# EAGLE design ul-18 (EAGLE 4.11)
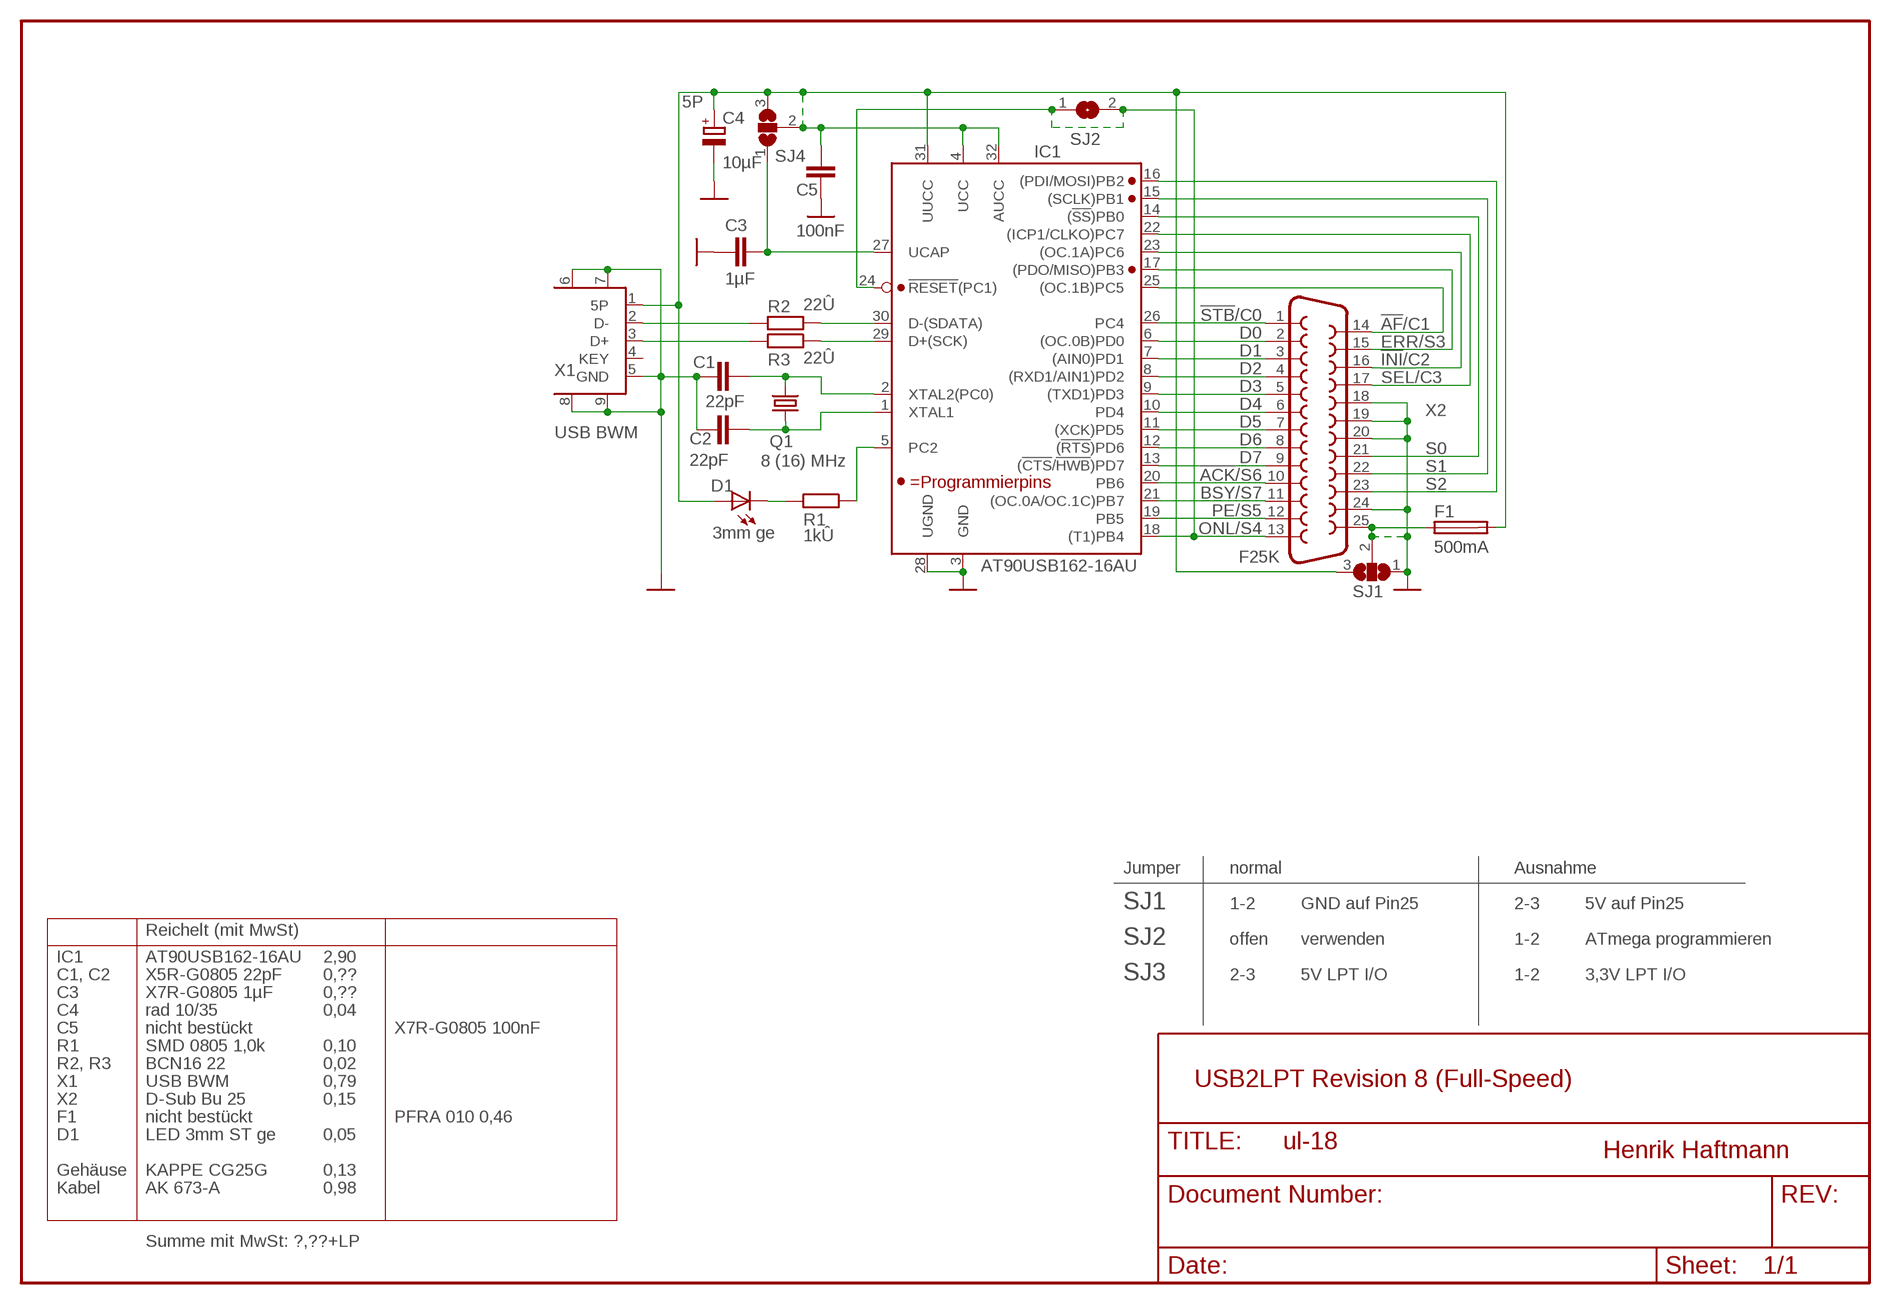
[diagram p0: schematic, sheet 1]

## Parts
C1  22pF  C-EUC0805  [C0805]
C2  22pF  C-EUC0805  [C0805]
C3  1µF  C-EUC0805  [C0805]
C4  10µF  CPOL-EUTT2D5L  [TT2D5L]
C5  100nF  C-EUC0805  [C0805]
D1  3mm ge  LED3MM  [LED3MM]
F1  500mA  TE5  [TE5]
IC1  AT90USB162-16AU  [TQFP32-08]
Q1  8 (16) MHz  CRYTALHC49U-V  [HC49U-V]
R1  1kÛ  R-EU_R0805  [R0805]
R2  22Û  R-EU_R0805  [R0805]
R3  22Û  R-EU_R0805  [R0805]
SJ1  SJ3P  [SJ3P]
SJ2  SJ2P  [SJ2P]
SJ4  SJ3P  [SJ3P]
X1  USB BWM  USB-MINIB-BO-E  [USB-MINIB-BU-E]
X2  F25K  [F25K]

## Nets
3P3: C3.2 IC1.27(UCAP) SJ4.1
5P: C4.+ C5.2 D1.A F1.2 IC1.4(UCC) IC1.31(UUCC) IC1.32(AUCC) SJ1.3 SJ4.2 SJ4.3 X1.1(5P)
!ACK!/S6: IC1.20(PB6) X2.10
!AF!/C1: IC1.25((OC.1B)PC5) X2.14
!INI!/C2: IC1.23((OC.1A)PC6) X2.16
!LED: IC1.5(PC2) R1.1
!SEL!/C3: IC1.22((ICP1/CLKO)PC7) X2.17
!STB!/C0: IC1.26(PC4) X2.1
BSY/S7: IC1.21((OC.0A/OC.1C)PB7) X2.11
D0: IC1.6((OC.0B)PD0) X2.2
D1: IC1.7((AIN0)PD1) X2.3
D2: IC1.8((RXD1/AIN1)PD2) X2.4
D3: IC1.9((TXD1)PD3) X2.5
D4: IC1.10(PD4) X2.6
D5: IC1.11((XCK)PD5) X2.7
D6: IC1.12((!RTS!)PD6) X2.8
D7: IC1.13((!CTS!/!HWB!)PD7) X2.9
D+: R2.2 X1.3(D+)
D-: R3.2 X1.2(D-)
ERR/S3: IC1.17((PDO/MISO)PB3) X2.15
GND: C1.2 C2.2 C3.1 C4.- C5.1 F1.1 IC1.3(GND) IC1.28(UGND) SJ1.1 SJ1.2 X1.5(GND) X1.6(GND) X1.7(GND) X1.8(GND) X1.9(GND) X2.18 X2.19 X2.20 X2.24 X2.25
N$3: IC1.30(D-(SDATA)) R3.1
N$4: IC1.29(D+(SCK)) R2.1
N$7: D1.K R1.2
ONL/S4: IC1.18((T1)PB4) IC1.24(!RESET!(PC1)) SJ2.1 SJ2.2 X2.13
PE/S5: IC1.19(PB5) X2.12
S0: IC1.14((!SS!)PB0) X2.21
S1: IC1.15((SCLK)PB1) X2.22
S2: IC1.16((PDI/MOSI)PB2) X2.23
XTAL1: C2.1 IC1.1(XTAL1) Q1.1
XTAL2: C1.1 IC1.2(XTAL2(PC0)) Q1.2
Unconnected: X1.4(KEY)

## Notes on the sheet
- Jumper | normal | Ausnahme
- SJ1 | 1-2 | GND auf Pin25 | 2-3 | 5V auf Pin25
- Reichelt (mit MwSt)
- SJ2 | offen | verwenden | 1-2 | ATmega programmieren
- IC1 | AT90USB162-16AU | 2,90
- C1, C2 | X5R-G0805 22pF | 0,?? | SJ3 | 2-3 | 5V LPT I/O | 1-2 | 3,3V LPT I/O
- C3 | X7R-G0805 1µF | 0,??
- C4 | rad 10/35 | 0,04
- C5 | nicht bestückt | X7R-G0805 100nF
- R1 | SMD 0805 1,0k | 0,10
- R2, R3 | BCN16 22 | 0,02
- X1 | USB BWM | 0,79 | USB2LPT Revision 8 (Full-Speed)
- X2 | D-Sub Bu 25 | 0,15
- F1 | nicht bestückt | PFRA 010 0,46
- D1 | LED 3mm ST ge | 0,05
- Henrik Haftmann
- Gehäuse | KAPPE CG25G | 0,13
- Kabel | AK 673-A | 0,98
- Summe mit MwSt: ?,??+LP

## Library data of the parts
C1-C3 C5 = rcl:C-EU: CAPACITOR, European symbol
C4 = rcl:CPOL-EU: POLARIZED CAPACITOR, European symbol
D1 = hs-ul:LED: Leuchtdiode 2 Anschlüsse
F1 = fuse:TE5: FUSE Wickmann
IC1 = hs-ul:AT90USB*: 8-bit-Mikrocontroller mit USB 16 MHz, 8/16 KByte Flash, 0,5 KB RAM, 0,5 KB EEPROM USB Full-Speed, 4 Endpoints, passender Quarz: 2..16 MHz 2 Timer, 1 UART mit RTS/CTS, SPI Kein ADC, I²C Anscheinend kein USB-Bootloader
Q1 = crystal:CRYTAL: CRYSTAL
R1-R3 = rcl:R-EU_: RESISTOR, European symbol
SJ1 SJ4 = hs-ul:SJ3P: Lötbrücke 3pol. Spaltbreite 0,15 mm
SJ2 = hs-ul:SJ2P: Lötbrücke 2pol. Spaltbreite 0,15 mm
X1 = hs-ul:USB-MINIB-BO: USB MiniB-Buchse Oberflächenmontage (Zwei Varianten zur Kantenmontage)
X2 = hs-ul:F25: SubD-Buchse korrigiert und verschönert Kantenmontage Reichelt D-SUB BU 25 0,14€

## Board
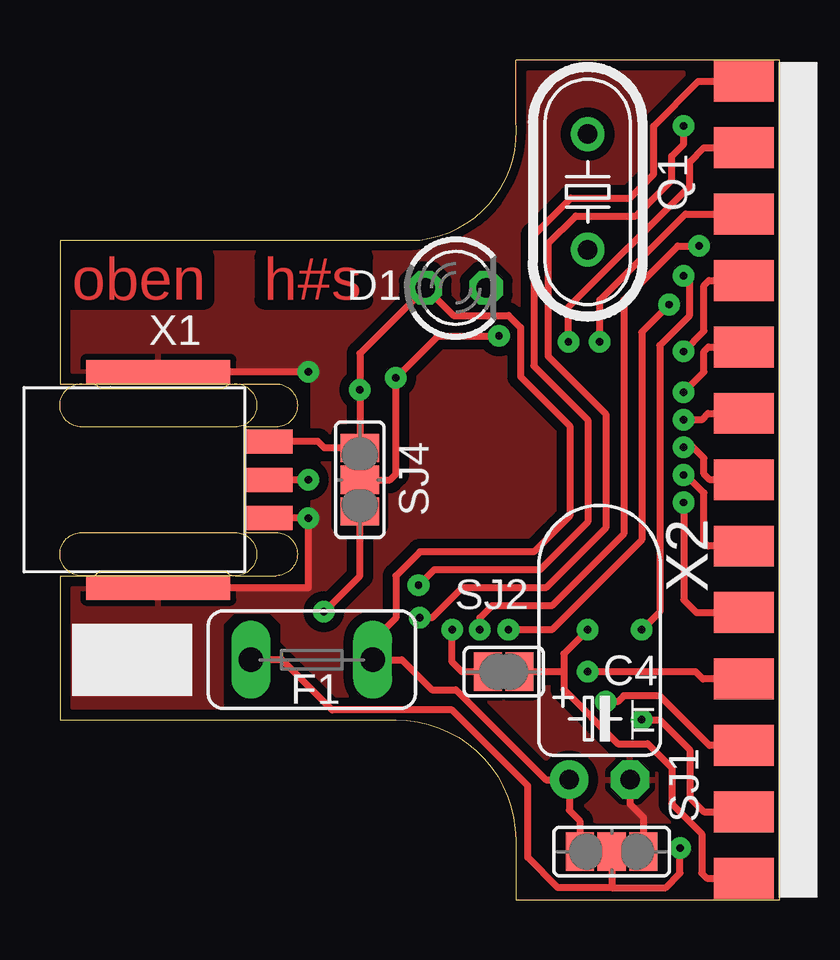
[diagram p1: board, top side]
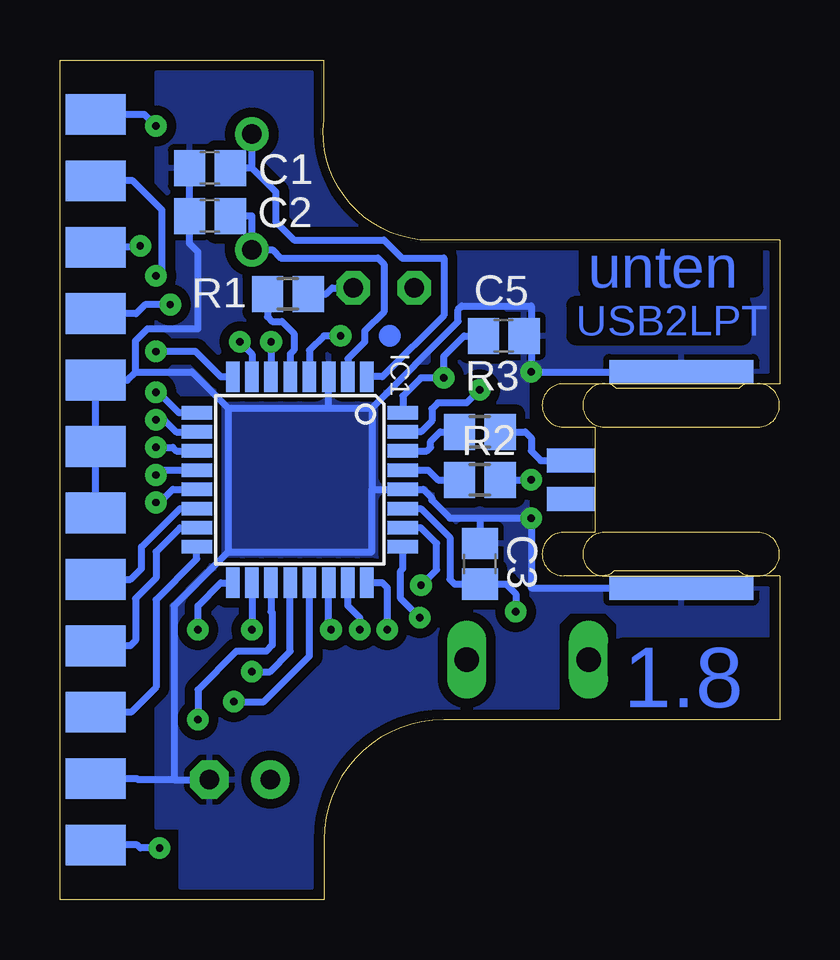
[diagram p2: board, bottom side, seen from below]

Size 30 x 35 mm. Coordinates in mm from the lower left corner, seen from the top.
Outline: 30,0 30,35 19,35 19,32.5 arc-90 15,27.5 0,27.5 0,21.5 1.25,21.5 arc-45 1.68,21.32 1.7,21.3 6.8,21.3 6.82,21.32 arc-45 7.25,21.5 9,21.5 arc-180 9,19.7 7.7,19.7 7.7,15.3 9,15.3 arc-180 9,13.5 7.33,13.5 arc-45 6.97,13.63 6.9,13.7 1.7,13.7 1.66,13.66 arc-45 1.13,13.5 0,13.5 0,7.5 14,7.5 arc-90 19,2.5 19,0 30,0
Copper layers (1*16): Top 0.035mm / dielectric 1.4mm / Bottom 0.035mm
Design rules "0,3mm": minimum track width 0.15mm, minimum drill 0.3mm, track to track 0.25mm, track to pad 0.25mm, pad to pad 0.15mm, via to via 0.25mm, smd to smd 0mil, copper to edge 0mil, drill to drill 0.3mm, minimum pad ring 0.3mm, minimum via ring 0.3mm, stop-mask expansion 4mil, vias tented up to drill 0.4mm, thermal gap 10mil
Milling: 8 lines

### Footprints (pad centres in the part's own frame; a part is rotated, then mirrored left to right if it is on the bottom)
C0805 = smd 1.3 x 1.5: 1 -0.85,0; 2 0.85,0
TT2D5L = drill 0.813 pad 1.6 round: + -1.27,0 | drill 0.813 pad 1.6 octagon: - 1.27,0
LED3MM = drill 0.813 octagon: A -1.27,0; K 1.27,0
TE5 = drill 1.016 long: 1 -2.54,0; 2 2.54,0
TQFP32-08 = smd 1.27 x 0.559: 1 -4.293,2.8; 2 -4.293,2; 3 -4.293,1.2; 4 -4.293,0.4; 5 -4.293,-0.4; 6 -4.293,-1.2; 7 -4.293,-2; 8 -4.293,-2.8; 17 4.293,-2.8; 18 4.293,-2; 19 4.293,-1.2; 20 4.293,-0.4; 21 4.293,0.4; 22 4.293,1.2; 23 4.293,2; 24 4.293,2.8 | smd 0.559 x 1.27: 9 -2.8,-4.293; 10 -2,-4.293; 11 -1.2,-4.293; 12 -0.4,-4.293; 13 0.4,-4.293; 14 1.2,-4.293; 15 2,-4.293; 16 2.8,-4.293; 25 2.8,4.293; 26 2,4.293; 27 1.2,4.293; 28 0.4,4.293; 29 -0.4,4.293; 30 -1.2,4.293; 31 -2,4.293; 32 -2.8,4.293
HC49U-V = drill 0.813 round: 1 -2.413,0; 2 2.413,0
R0805 = smd 1.3 x 1.5: 1 -0.85,0; 2 0.85,0
SJ3P = smd 1.168 x 1.6: 1 -1.324,0; 2 0,0; 3 1.324,0
SJ2P = smd 1.168 x 1.6: 1 -0.662,0; 2 0.662,0
USB-MINIB-BU-E = smd 2 x 1: 1 9.6,1.6; 3 9.6,0; 5 9.6,-1.6 | smd 2 x 1 bottom: 2 9.6,0.8; 4 9.6,-0.8 | smd 6 x 1 bottom: 6 5,4.5; 9 5,-4.5 | smd 6 x 1: 7 5,4.5; 8 5,-4.5
F25K = smd 1.7 x 2.5: 1 -16.612,-1.75; 2 -13.843,-1.75; 3 -11.074,-1.75; 4 -8.306,-1.75; 5 -5.537,-1.75; 6 -2.769,-1.75; 7 0,-1.75; 8 2.769,-1.75; 9 5.537,-1.75; 10 8.306,-1.75; 11 11.074,-1.75; 12 13.843,-1.75; 13 16.612,-1.75 | smd 1.7 x 2.5 bottom: 14 -15.227,-1.75; 15 -12.459,-1.75; 16 -9.69,-1.75; 17 -6.921,-1.75; 18 -4.153,-1.75; 19 -1.384,-1.75; 20 1.384,-1.75; 21 4.153,-1.75; 22 6.921,-1.75; 23 9.69,-1.75; 24 12.459,-1.75; 25 15.227,-1.75

### Placement (x,y rotation side)
C1  23.75,28.5 180 bottom
C2  23.75,30.5 180 bottom
C3  12.5,14 270 bottom
C4  22.5,5 0 top
C5  11.5,23.5 180 bottom
D1  16.5,25.5 0 top
F1  10.5,10 0 top
IC1  20,17.5 270 bottom
Q1  22,29.5 270 top
R1  20.5,25.25 0 bottom
R2  12.5,17.5 0 bottom
R3  12.5,19.5 0 bottom
SJ1  23,2 180 top
SJ2  18.5,9.5 0 top
SJ4  12.5,17.5 90 top
X1  -0.9,17.5 0 top
X2  30.25,17.5 270 top

### Tracks (layer width: path | path; a pad name or v marks a point on that pad's centre or on a via)
3P3  (via drill 0.3)
  Top 0.3: v11,12 12.5,13.5 SJ4.1
  Bottom 0.3: IC1.27 14.95,16.3 13.75,15.1 13.75,13.35 13.55,13.15 C3.2 11.4,13.15 11,12.75 v11,12 11,11.95
5P  (via drill 0.3)
  Top 0.15: SJ4.3 SJ4.2
  Top 0.3: SJ4.2 13.75,17.5 14,17.75 v14,21.75 15.75,23.5 v18.3,23.5 | X1.1 10.75,19.1 11.03,18.82 SJ4.3 v12.5,21.25 12.5,22.77 D1.A 15.25,25.5 16.4,24.35 18.7,24.35 19.2,23.85 19.2,21.8 21.25,19.75 21.25,16 19.75,14.5 15,14.5 14,13.5 14,11.75 13.04,10.79 F1.2 14.25,10 15.5,8.75 16.5,8.75 20.25,5 C4.+ 21.23,3.72 21.68,3.27 SJ1.3
  Bottom 0.3: IC1.4 19.6,22.9 19,23.5 v18.3,23.5 | IC1.32 15.71,20.99 14.95,21.75 v14,21.75 14,22.65 13.15,23.5 C5.2 | IC1.31 14.95,19.5 14.5,19.95 14.5,20.45 14.25,20.7 13.05,20.7 v12.5,21.25
!ACK!/S6  (via drill 0.3)
  Top 0.3: X2.10 26.81,9.19 26.5,9.5 v22,9.5
  Bottom 0.3: v22,9.5 21.25,9.5 20.4,10.35 IC1.20
!AF!/C1  (via drill 0.3)
  Top 0.3: v15,11.75 15.5,11.75 16.75,13 20.25,13 22.75,15.5 22.75,20.25 20.35,22.65 20.35,27.35 21.5,28.5 24,28.5 25.5,30 25.5,31 26,31.5 v26,32.25
  Bottom 0.3: v15,11.75 15.7,12.45 | 15.7,12.45 15.71,12.46 | X2.14 26.48,32.73 v26,32.25 | IC1.25 15.71,13.79 15.8,13.7 15.8,12.55 15.7,12.45
!INI!/C2  (via drill 0.3)
  Top 0.3: v26.65,27.25 25.75,27.25 23.5,25 23.5,15.25 20.5,12.25 18,12.25 17.5,11.75 v17.5,11.25
  Bottom 0.15: 18.05,13.15 IC1.23
  Bottom 0.3: X2.16 26.71,27.19 v26.65,27.25 | IC1.23 18,12.25 17.5,11.75 v17.5,11.25
!LED
  Bottom 0.3: R1.1 21.35,24.3 21.15,24.1 20.75,24.1 20.25,23.6 20.25,22.9 20.4,22.75 IC1.5
!SEL!/C3  (via drill 0.3)
  Top 0.3: v25.4,24.8 24.25,23.65 24.25,15 20.5,11.25 v18.7,11.25
  Bottom 0.3: X2.17 26.83,24.42 26.45,24.8 v25.4,24.8 | IC1.22 18.8,11.35 v18.7,11.25
!STB!/C0  (via drill 0.3)
  Top 0.3: X2.1 26.61,34.11 24.75,32.25 24.75,30.25 23.75,29.25 21.3,29.25 19.75,27.7 19.75,22.25 22,20 22,15.75 20,13.75 15.6,13.75 v14.95,13.1
  Bottom 0.3: IC1.26 14.95,15.5 14.3,14.85 14.3,13.75 v14.95,13.1
BSY/S7  (via drill 0.3)
  Top 0.3: v22.75,8.25 23.25,8.25 23.5,8.5 25,8.5 27.07,6.43 X2.11
  Bottom 0.3: v22.75,8.25 21.5,8.25 19.6,10.15 IC1.21
D0  (via drill 0.3)
  Top 0.3: v21.2,23.25 21.2,24.7 26.25,29.75 26.25,30.75 26.84,31.34 X2.2
  Bottom 0.3: v21.2,23.25 IC1.6
D1  (via drill 0.3)
  Top 0.3: v22.5,23.25 22.5,25 26.07,28.57 X2.3
  Bottom 0.3: IC1.7 22,22.75 v22.5,23.25
D2  (via drill 0.3)
  Top 0.3: v26,22.85 26.85,23.7 26.85,25.6 27.06,25.81 X2.4
  Bottom 0.3: IC1.8 23.29,21.79 24.35,22.85 v26,22.85
D3  (via drill 0.3)
  Top 0.3: v26,21.15 26.85,22 26.85,22.85 27.04,23.04 X2.5
  Bottom 0.3: IC1.9 25.05,20.3 25.9,21.15 v26,21.15
D4  (via drill 0.3)
  Top 0.3: X2.6 27.02,20.27 26.75,20 v26,20
  Bottom 0.3: IC1.10 25.15,19.5 25.65,20 v26,20
D5  (via drill 0.3)
  Top 0.3: X2.7 27.1,17.5 26.85,17.75 26.85,18.4 26.4,18.85 v26,18.85
  Bottom 0.3: v26,18.85 25.3,18.85 25.15,18.7 IC1.11
D6  (via drill 0.3)
  Top 0.3: X2.8 27.02,14.73 26.85,14.9 26.85,16.95 26.1,17.7 v26,17.7
  Bottom 0.3: IC1.12 25.8,17.9 v26,17.7
D7  (via drill 0.3)
  Top 0.3: v26,16.55 26,12.5 26.54,11.96 X2.9
  Bottom 0.3: IC1.13 25.3,17.1 25.85,16.55 v26,16.55
D+  (via drill 0.3)
  Top 0.3: v10.35,17.5 X1.3
  Bottom 0.3: R2.2 v10.35,17.5
D-
  Bottom 0.3: X1.2 9.95,18.3 10.35,18.7 10.35,19.25 10.6,19.5 R3.2
ERR/S3  (via drill 0.3)
  Top 0.3: v26,26 26.25,25.75 26.25,24.35 25,23.1 25,12 v24.25,11.25
  Bottom 0.3: X2.15 26.96,29.96 25.75,28.75 25.75,26.25 v26,26 | v24.25,11.25 24.25,12.25 23.29,13.21 IC1.17
GND  (via drill 0.3)
  Top 0.15: SJ1.1 SJ1.2
  Top 0.3: v10.35,22 X1.7 | X1.5 v10.35,15.9 10.35,13 X1.8 | C4.- 23.77,3.98 24.32,3.43 SJ1.1 | v25.85,2.15 25.85,1.1 25.25,0.5 23,0.5 | SJ1.2 23,0.5 | 23,0.5 20.75,0.5 19.5,1.75 19.5,4.75 16.35,7.9 11.35,7.9 9.25,10 F1.1
  Bottom 0.15: X2.20 28.5,16.16 | X1.7 4,22
  Bottom 0.3: X1.7 v10.35,22 10.35,23.5 | 10.35,23.5 C5.1 | 10.35,23.5 10.35,24.75 13.25,24.75 13.4,24.6 13.4,24.1 17,20.5 | 12.5,15.9 13.75,15.9 14.5,16.65 14.5,16.75 14.85,17.1 IC1.28 17,17.1 | 12.5,15.9 v10.35,15.9 10.35,13 X1.8 | 12.5,15.9 C3.1 | 18.8,20.5 IC1.3 | 18.8,20.5 17,20.5 | 17,17.1 17,14.5 23,14.5 | 17,20.5 17,17.1 | 23,20.5 18.8,20.5 | 23,20.5 23,14.5 | 28.5,16.16 X2.19 X2.18 27.2,21.65 26.85,22 | 26.85,22 24.5,22 23,20.5 | 23,14.5 25.25,12.25 25.25,5 | 25.25,5 C4.- | X2.24 26.79,5.04 26.75,5 25.25,5 | 26.85,22 26.85,23.3 26.35,23.8 24.25,23.8 24.25,27 24.6,27.35 C1.2 C2.2 | X2.25 26.77,2.27 26.65,2.15 v25.85,2.15
  pour Bottom (isolate 0.4): 19.5,34.5 26,34.5 26,3 25,3 25,0.5 19.5,0.5 19.5,2.5 arc90 14,8 9.25,8 9.25,11.5 8.75,12 7.25,12 6.75,11.5 6.75,8 0.5,8 0.5,13 10.5,13 10.5,22 0.5,22 0.5,27 14.5,27 arc90 19.5,32
  pour Top (isolate 0.4): 0.5,27 0.5,22 10.5,22 10.5,13 0.5,13 0.5,8 6.75,8 6.75,11.5 7.25,12 8.75,12 9.25,11.5 9.25,10.75 11.5,8.5 16.5,8.5 21.75,3.25 26,3.25 26,34.5 19.5,34.5 19.5,32.02 arc-90 14.48,27
N$3
  Bottom 0.3: R3.1 14.15,19.5 14.55,19.1 14.55,18.85 14.7,18.7 IC1.30
N$4
  Bottom 0.3: IC1.29 14.65,17.9 14.25,17.5 R2.1
N$7
  Bottom 0.3: R1.2 18.9,25.25 18.65,25.5 D1.K
ONL/S4  (via drill 0.3)
  Top 0.15: SJ2.2 SJ2.1
  Top 0.3: X2.13 26.96,0.89 26.75,1.1 26.75,2.75 25.5,4 25.5,5.5 24.5,6.5 23.25,6.5 21,8.75 21,9.5 | v16.35,11.25 16.35,9.9 16.75,9.5 SJ2.1 | 21,9.5 21,10.25 v22,11.25 | 21,9.5 SJ2.2
  Bottom 0.3: IC1.18 v22,11.25 | IC1.24 16.56,13.21 16.35,13 v16.35,11.25
PE/S5  (via drill 0.3)
  Top 0.3: v24.25,7.5 25,7.5 26.25,6.25 26.25,4.25 26.84,3.66 X2.12
  Bottom 0.3: IC1.19 21.2,12 21.15,11.95 21.15,10.61 21.41,10.35 22.65,10.35 24.25,8.75 v24.25,7.5
S0
  Bottom 0.3: IC1.14 25,16.3 26.6,14.7 26.6,13.8 27.05,13.35 X2.21
S1
  Bottom 0.3: IC1.15 25,15.5 26,14.5 26,13.4 26.85,12.55 26.85,10.8 27.07,10.58 X2.22
S2
  Bottom 0.3: X2.23 27.04,7.81 26,8.85 26,12.5 24.29,14.21 IC1.16
XTAL1
  Bottom 0.3: IC1.1 16.56,21.79 14,24.35 14,26.75 15.75,26.75 16.5,27.5 20.25,27.5 21,28.25 21,29.5 22,30.5 | 22,30.5 Q1.1 | 22,30.5 C2.1
XTAL2
  Bottom 0.3: IC1.2 18,22.55 17.3,23.25 17.3,23.7 16.5,24.5 16.5,26.5 16.75,26.75 20.8,26.75 21.14,27.09 Q1.2 22,28.5 C1.1
(copper drawn outside any net)
  shapes: Bottom circle x1

### Text on the board
Top: oben | h#s
Bottom: unten | USB2LPT | 1.8
Measures: 8 | 35 | 20 | R5 | 11 | 30